# EAGLE design RelayBoard for M15F (EAGLE 6.3)
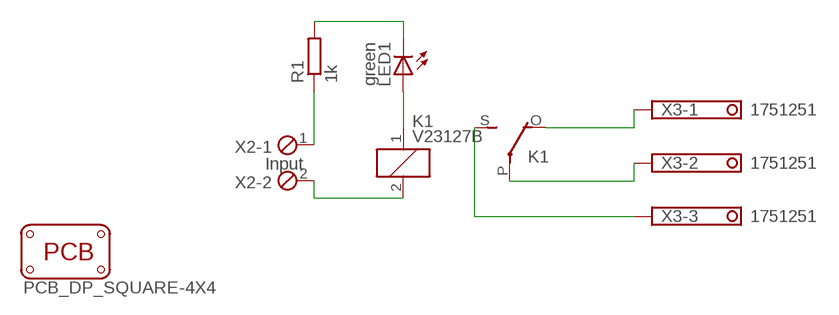
[diagram p0: schematic, sheet 1]

## Parts
K1  V23127B  [V23127B]
LED1  green  LED-0805  [LED-805]
PCB1  PCB_DP_SQUARE-4X4  [DP4040_V1]
R1  1k  RESISTORR805-0805  [R805]
X2  Input  MPT2  [2POL254]
X3  1751251  [1751251]

## Nets
N$1: R1.1 X2.1
N$2: LED1.C R1.2
N$3: K1.1 LED1.A
N$4: K1.2 X2.2
N$5: K1.P(2:P) X3.2
N$6: K1.O(2:O) X3.1
N$7: K1.S(2:S) X3.3

## Library data of the parts
K1 = relay:V23127B: RELAY vertical, 1 x switch, 5 A/300 V DC, 250 V AC, Siemens; OC_FARNELL: unknown; OC_NEWARK: unknown
LED1 = dp_devices:LED: Light Emitting Diode
PCB1 = dp_pcb:PCB_DP_SQUARE: Dangerous Prototypes Standard Square PCB sizes
R1 = dp_devices:RESISTOR
X2 = con-phoenix-254:MPT2: PHOENIX CONNECTOR; OC_FARNELL: unknown; OC_NEWARK: unknown
X3 = con-phoenix-350:1751251: MKDS 1/ 3-3,5 Printklemme Nennstrom: 10 A Bemessungsspannung: 160 V Raster: 3,5 mm Polzahl: 3 Montageart: Löten Anschlussart: Schraubanschluss Anschlussrichtung vom Leiter zur Platine: 0° Source: http://eshop.phoenixcontact.com .. 1751251.pdf; OC_FARNELL: unknown; OC_NEWARK: unknown

## Board
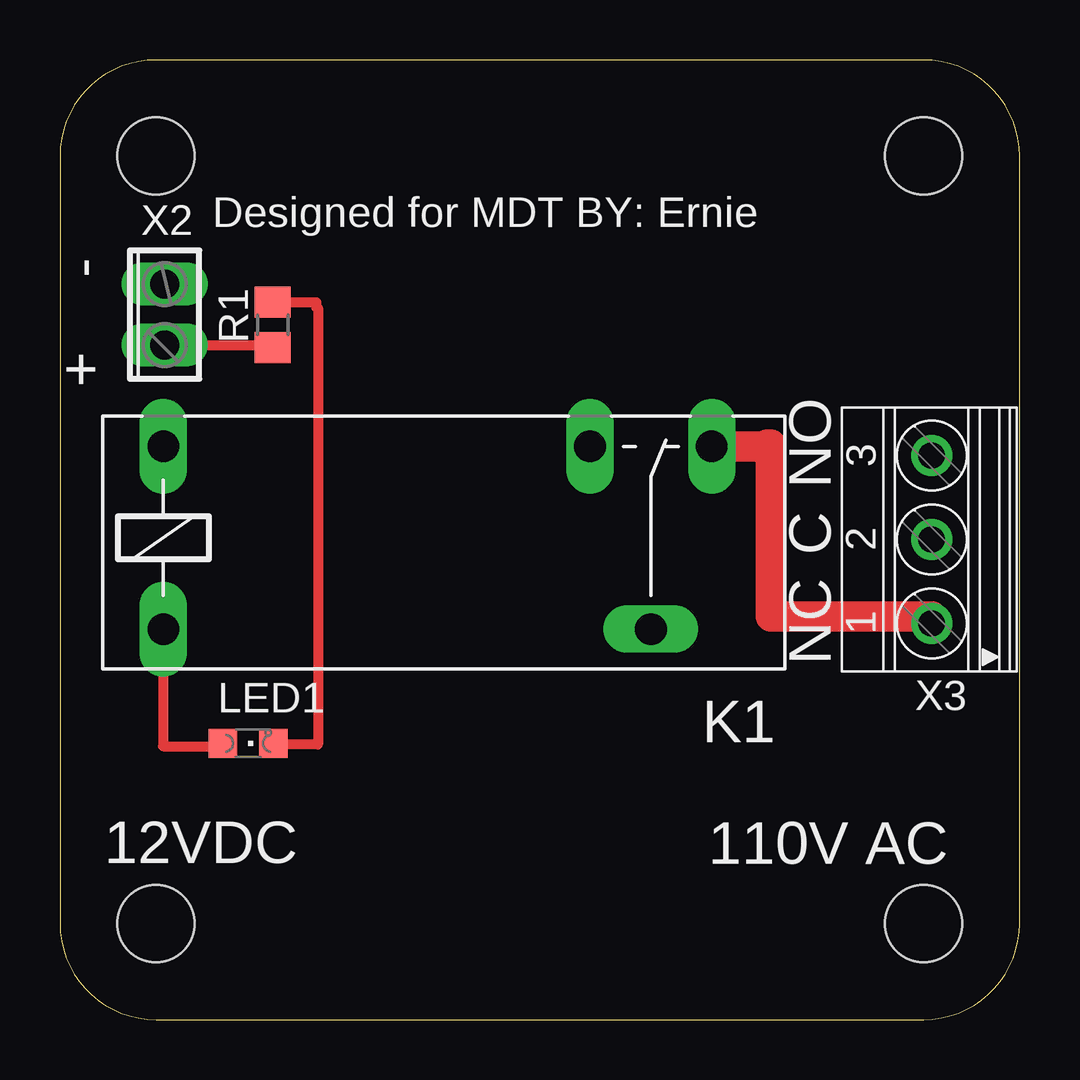
[diagram p1: board, top side]
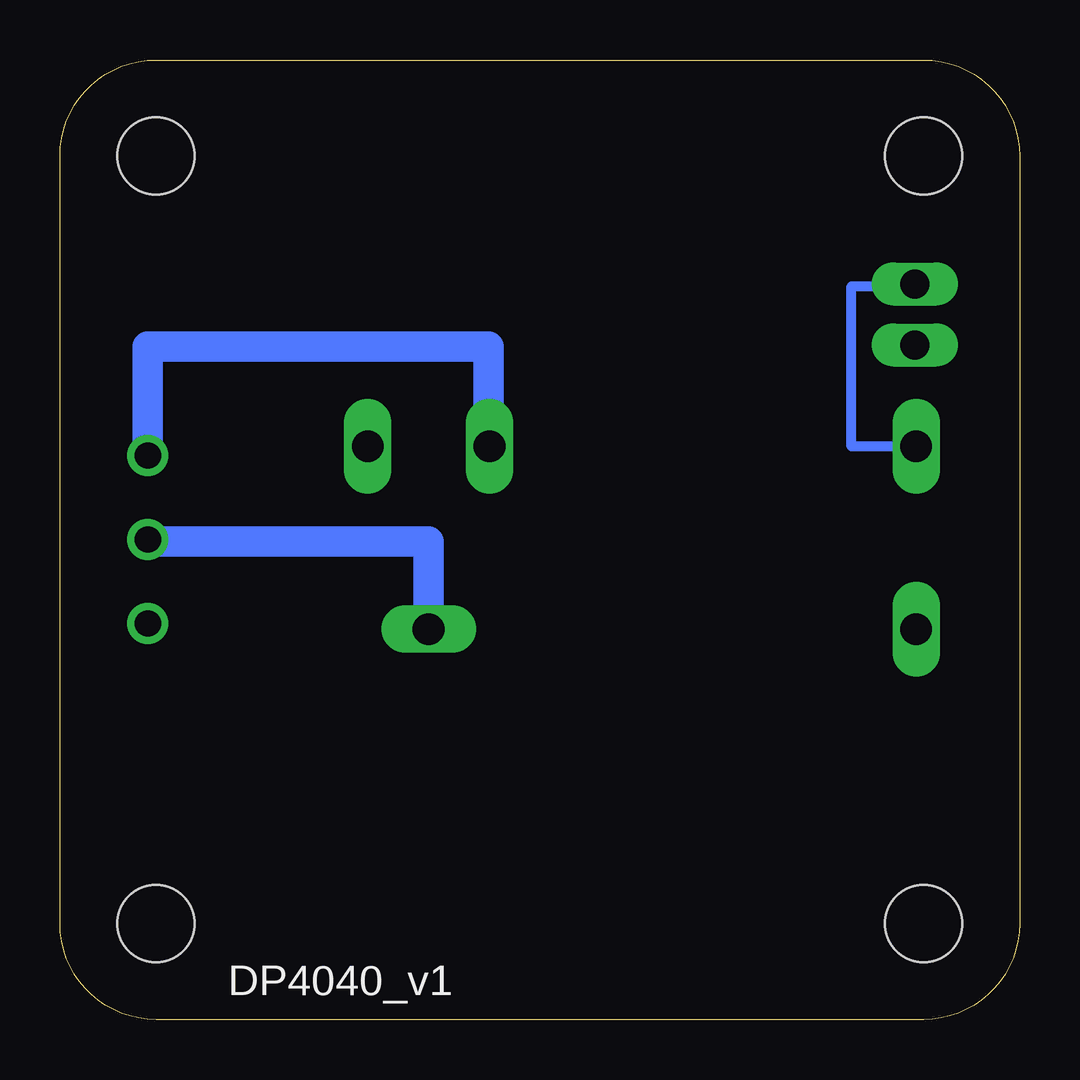
[diagram p2: board, bottom side, seen from below]

Size 40 x 40 mm. Coordinates in mm from the lower left corner, seen from the top.
Copper layers (1*16): Top 0.035mm / dielectric 1.5mm / Bottom 0.035mm
Design rules "Fusion_eagle_rule_v1.1 *": minimum track width 6mil, minimum drill 12mil, track to track 12mil, track to pad 6mil, pad to pad 6mil, via to via 6mil, smd to smd 0mil, copper to edge 10mil, drill to drill 10mil, minimum pad ring 10mil, minimum via ring 6mil, stop-mask expansion 2mil, vias tented up to drill 100mil, thermal gap 10mil

### Footprints (pad centres in the part's own frame; a part is rotated, then mirrored left to right if it is on the bottom)
V23127B = drill 1.321 long: 1 0,-3.81; 2 0,3.81; O 22.86,3.81; P 20.32,-3.81; S 17.78,3.81
LED-805 = smd 1.2 x 1.2: A 0,-1.05; C 0,1.05
DP4040_V1 = hole 3.2: 4,4; 36,4; 36,36; 4,36
R805 = smd 1.3 x 1.5: 1 -0.95,0; 2 0.95,0
2POL254 = drill 1.2 long: 1 -1.27,0; 2 1.27,0
1751251 = drill 1.1 pad 1.7: 1 -3.5,-0.1; 2 0,-0.1; 3 3.5,-0.1

### Placement (x,y rotation side)
K1  4.31,20.09 0 top
LED1  7.84,11.51 270 top
PCB1  0,0 0 top
R1  8.87,28.96 90 top
X2  4.36,29.39 90 top
X3  36.24,20.01 90 top

### Tracks (layer width: path | path; a pad name or v marks a point on that pad's centre or on a via)
N$1
  Top 0.406: X2.1 8.87,28.12 R1.1
N$2
  Top 0.406: R1.2 10.69,29.91 10.69,29.66 10.76,29.66 10.76,11.46 8.89,11.46 LED1.C
N$3
  Top 0.406: K1.1 4.3,11.39 6.79,11.39 LED1.A
N$4
  Bottom 0.406: K1.2 7.01,23.89 7.01,30.56 4.36,30.56 X2.2
N$5
  Bottom 1.27: K1.P 24.63,19.93 36.34,19.93 X3.2
N$6
  Top 1.27: K1.O 29.49,23.89 29.49,23.96 29.63,23.96 29.63,16.81 36.34,16.81 X3.1
N$7
  Bottom 1.27: K1.S 22.14,23.89 22.14,28.06 36.35,28.06 36.35,27.78 36.34,27.78 X3.3

### Text on the board
_tsilk: Designed for MDT BY: Ernie | - | + | NO | C | NC | 12VDC | 110V AC